# Altium project DCDC_1.0.0.PrjPCB
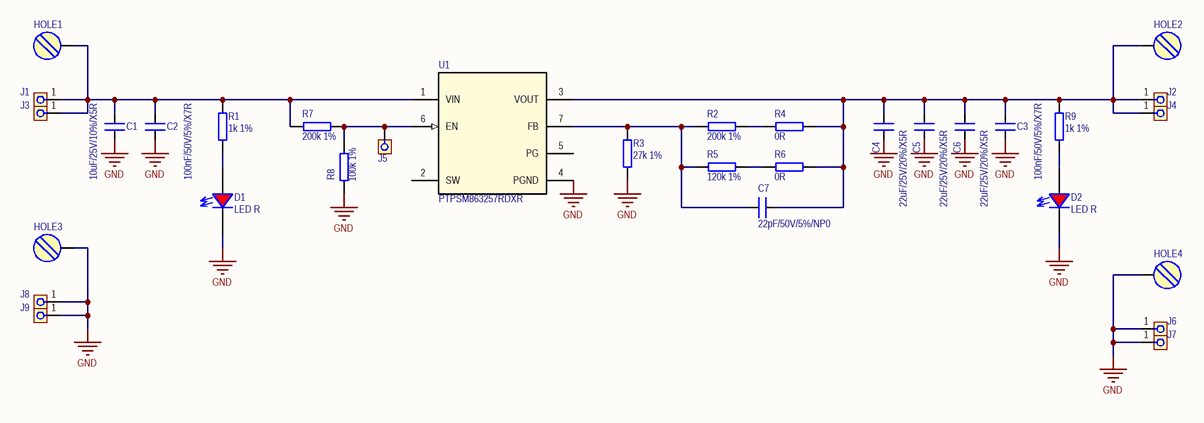
[diagram p0: 00-Main.SchDoc]
Date: 03/2026; ProjectTitle: DCDC; Version: 1.0.0
1 sheet, 32 parts. Net scope: hierarchical (ports join the sheet entries above them; power ports are global).
Board file: DCDC_1.0.0.PcbDoc

## Sheet 00-Main.SchDoc
size A4; Address4: Czech Republic; DocumentNumber: 1; SheetNumber: 1; SheetTotal: 1

### Parts
C1  10uF/25V/10%/X5R  [C-0805]
C2  100nF/50V/5%/X7R  [C-0603]
C3  100nF/50V/5%/X7R  [C-0603]
C4  22uF/25V/20%/X5R  [C-0805]
C5  22uF/25V/20%/X5R  [C-0805]
C6  22uF/25V/20%/X5R  [C-0805]
C7  22pF/50V/5%/NP0  [C-0603]
D1  LED R  [LED-0603 RED]
D2  LED R  [LED-0603 RED]
HOLE1  Hole M2.5 screw  [M2.5 Screw hole]  (value not drawn)  (no BOM)
HOLE2  Hole M2.5 screw  [M2.5 Screw hole]  (value not drawn)  (no BOM)
HOLE3  Hole M2.5 screw  [M2.5 Screw hole]  (value not drawn)  (no BOM)
HOLE4  Hole M2.5 screw  [M2.5 Screw hole]  (value not drawn)  (no BOM)
J1  PAD1G01  [HDR1X01S]  (value not drawn)
J2  PAD1G01  [HDR1X01S]  (value not drawn)
J3  PAD1G01  [HDR1X01S]  (value not drawn)
J4  PAD1G01  [HDR1X01S]  (value not drawn)
J5  PAD1G01  [HDR1X01S]  (value not drawn)
J6  PAD1G01  [HDR1X01S]  (value not drawn)
J7  PAD1G01  [HDR1X01S]  (value not drawn)
J8  PAD1G01  [HDR1X01S]  (value not drawn)
J9  PAD1G01  [HDR1X01S]  (value not drawn)
R1  1k 1%  [R-0603]
R2  200k 1%  [R-0603]
R3  27k 1%  [R-0603]
R4  0R  [R-0603-SB]
R5  120k 1%  [R-0603]
R6  0R  [R-0603-SB]
R7  200k 1%  [R-0603]
R8  100k 1%  [R-0603]
R9  1k 1%  [R-0603]
U1  PTPSM863257RDXR  [RDX0007A-MFG]

### Nets
GND: C1.1 C2.1 C3.1 C4.1 C5.1 C6.1 D1.1(K) D2.1(K) HOLE3.1 HOLE4.1 J6.1 J7.1 J8.1 J9.1 R3.2 R8.1 U1.4(PGND)
NetC1_2: C1.2 C2.2 HOLE1.1 J1.1 J3.1 R1.1 R7.1 U1.1(VIN)
NetC3_2: C3.2 C4.2 C5.2 C6.2 C7.2 HOLE2.1 J2.1 J4.1 R4.2 R6.2 R9.1 U1.3(VOUT)
NetC7_1: C7.1 R2.1 R3.1 R5.1 U1.7(FB)
NetD1_2: D1.2(A) R1.2
NetD2_2: D2.2(A) R9.2
NetJ5_1: J5.1 R7.2 R8.2 U1.6(EN)
NetR2_2: R2.2 R4.1
NetR5_2: R5.2 R6.1

Not connected (* = marked no-connect by the designer): U1 2(SW) 5(PG)

### Notes on the sheet
- Title
- Size:
- Sheet
- A4
- Number:
- Revision:
- Date:
- Time:
- of

### Library data of the parts
C1 = CMP-034-0080-6: SMD Ceramic Capacitor 0805 10uF/25V/10%/X5R; IFS Description prefix: CAP-0805 10uF/25V/10%/X5R; IFS PN: 114548; Capacitance: 10uF; Dielectric: X5R; Tolerance: 10%; Voltage: 25V; Case/Package: 0805; Part Status: Unknown; LCSC: C15850
C2 C3 = CMP-001-00102-2: SMD Ceramic Capacitor 0603 100nF/50V/5%/X7R; IFS Description prefix: CAP-0603 4.7uF/10V/10%/X5R; IFS PN: 102637; Capacitance: 100nF; Dielectric: X7R; Tolerance: 5%; Voltage: 50V; Case/Package: 0603; Part Status: Unknown; LCSC: C14663
C4-C6 = CMP-034-0192-6: SMD Ceramic Capacitor 0805 22uF/25V/20%/X5R; Voltage: 25V; Tolerance: 20%; Dielectric: X5R; IFS PN: 101494; Capacitance: 22uF; IFS Description prefix: CAP-0805 22uF/25V/20%/X5R; Case/Package: 0805; Part Status: Unknown; LCSC: C45783
C7 = CMP-034-0036-7: SMD Ceramic Capacitor 0603 22pF/50V/5%/NP0; IFS PN: 102554; Voltage: 50V; Tolerance: 5%; IFS Description prefix: CAP-0603 22pF/50V/5%/NP0; Capacitance: 22pF; Dielectric: NP0; Part Status: Unknown; Case/Package: 0603; LCSC: C1653
D1 D2 = CMP-007-00003-1: LED; SMD; 0603; červená; 8-15mcd; 1,6x0,8x1,1mm; 150°; 2,0÷2,5V; 20mA; IFS Description prefix: DIO-APT1608EC; IFS PN: 102044; Case/Package: LED-0603; Part Status: Active; LCSC: C2286
HOLE1-HOLE4 = CMP-00028-00012-1: Hole for M2.5 screw; Part Status: Unknown
J1-J9 = CMP-002-00043-1: 1x1pin single pad; IFS Description prefix: CON-PAD1G02
R1 R9 = CMP-048-0019-7: SMD Resistor 0603 1k 1%; IFS Description prefix: RES-0603 1k 1%; IFS PN: 105590; Power: 100mW; Case/Package: 0603; Part Status: Unknown; Tolerance: 1%; Value: 1k; LCSC: C21190
R2 R7 = CMP-048-0111-7: SMD Resistor 0603 200k 1%; IFS Description prefix: RES-0603 200k 5%; IFS PN: 100319; Power: 100mW; Tolerance: 5%; Case/Package: 0603; Part Status: Unknown; Value: 200k; LCSC: C25811
R3 = CMP-048-0152-7: SMD Resistor 0603 27k 1%; IFS Description prefix: RES-0603 30k 1%; IFS PN: 114999; Power: 100mW; Value: 30k; Case/Package: 0603; Part Status: Unknown; Tolerance: 1%; LCSC: C22967
R4 R6 = CMP-048-0001-9: SMD Resistor 0603 0R; IFS Description prefix: RES-0603 0R; Power: 100mW; IFS PN: 100039; Tolerance: 5%; Value: 0R; Case/Package: 0603; Part Status: Active; LCSC: C21189
R5 = CMP-048-0152-7: SMD Resistor 0603 120k 1%; IFS Description prefix: RES-0603 30k 1%; IFS PN: 114999; Power: 100mW; Value: 30k; Case/Package: 0603; Part Status: Unknown; Tolerance: 1%; LCSC: C25808
R8 = CMP-048-0002-7: SMD Resistor 0603 100k 1%; IFS Description prefix: RES-0603 100k 1%; IFS PN: 102703; Power: 100mW; Case/Package: 0603; Part Status: Unknown; Tolerance: 1%; Value: 100k; LCSC: C25803
U1 = PTPSM863257RDXR: 3-V to 17-V input voltage, 3-A forced-CCM synchronous buck module 7-QFN-FCMOD -40 to 125; Manufacturer_Name: Texas Instruments; TYPE: TYPE; RefDes: RefDes; Copyright: Copyright (C) 2026 Ultra Librarian. All rights reserved.; Manufacturer_Part_Number: PTPSM863257RDXR; LCSC: C19190416

## Assembly variants
Default: not fitted HOLE1 HOLE2 HOLE3 HOLE4 J1 J2 J3 J4 J5 J6 J7 J8 J9 R4